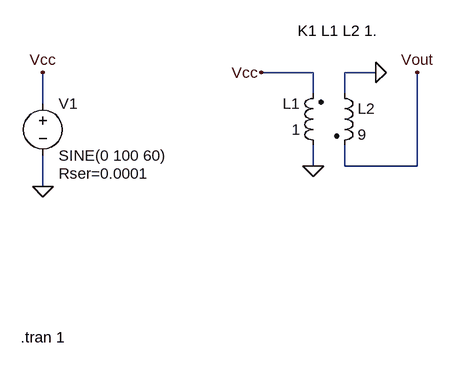
[diagram p0: schematic transformador.asc]
transformador.asc, the LTspice schematic file:
Version 4
SHEET 1 880 680
WIRE 176 80 96 80
WIRE 272 80 224 80
WIRE 176 112 176 80
WIRE 224 112 224 80
WIRE -240 128 -240 80
WIRE 176 224 176 192
WIRE 224 224 224 192
WIRE 336 224 336 80
WIRE 336 224 224 224
WIRE -240 256 -240 208
FLAG -240 256 0
FLAG -240 80 Vcc
FLAG 96 80 Vcc
FLAG 176 224 0
FLAG 336 80 Vout
FLAG 272 80 0
SYMBOL ind2 192 208 R180
WINDOW 0 36 80 Left 2
WINDOW 3 36 40 Left 2
SYMATTR InstName L1
SYMATTR Value 1
SYMBOL ind2 208 96 R0
SYMATTR InstName L2
SYMATTR Value 9
SYMBOL voltage -240 112 R0
WINDOW 123 0 0 Left 0
WINDOW 39 24 124 Left 2
SYMATTR InstName V1
SYMATTR Value SINE(0 100 60)
SYMATTR SpiceLine Rser=0.0001
TEXT 152 16 Left 2 !K1 L1 L2 1.
TEXT -274 488 Left 2 !.tran 1

The netlist it stands for:
* transformador.asc
L1 0 Vcc 1
L2 0 Vout 9
V1 Vcc 0 SINE(0 100 60) Rser=0.0001
K1 L1 L2 1.
.tran 1
.backanno
.end